# EAGLE design twilight-esp (EAGLE 7.5.0)
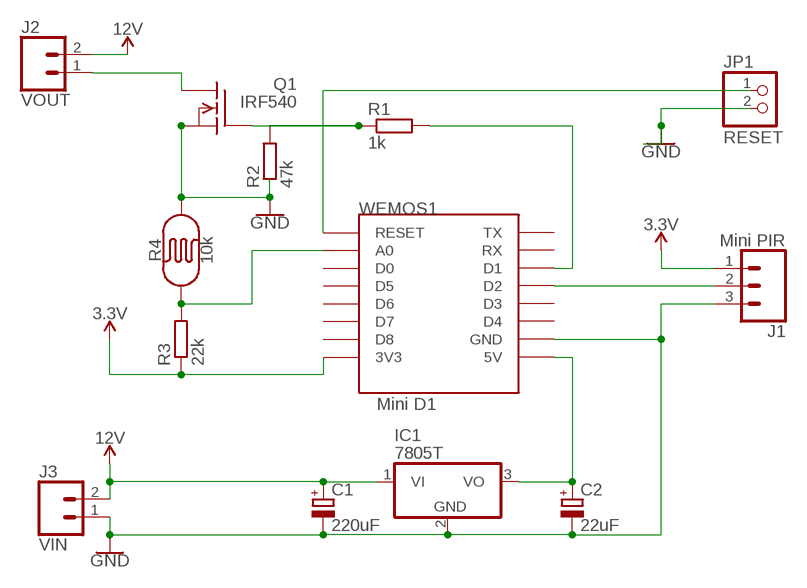
[diagram p0: schematic, sheet 1]

## Parts
C1  220uF  CPOL-EUE2-5  [E2-5]
C2  22uF  CPOL-EUE2-4  [E2-4]
IC1  7805T  [TO220H]
J1  Mini PIR  CONN_03  [1X03]
J2  VOUT  CONN_025MM  [SCREWTERMINAL-5MM-2]
J3  VIN  CONN_025MM  [SCREWTERMINAL-5MM-2]
JP1  RESET  PINHD-1X2  [1X02]
Q1  IRF540  [TO220]
R1  1k  R-EU_0207/7  [0207/7]
R2  47k  R-EU_0207/7  [0207/7]
R3  22k  R-EU_0207/7  [0207/7]
R4  10k  PHOTOCELLPTH  [PHOTOCELL]
WEMOS1  Mini D1  WEMOS-D1-MINI  [WEMOS-D1-MINI]

## Nets
3.3V: J1.1 R3.1 WEMOS1.3V3
12V: C1.+ IC1.1(VI) J2.2 J3.2
GND: C1.- C2.- IC1.2(GND) J1.3 J3.1 JP1.2 Q1.3(S) R2.1 R4.2 WEMOS1.GND
N$1: R1.2 WEMOS1.D1
N$2: Q1.1(G) R1.1 R2.2
N$3: R3.2 R4.1 WEMOS1.A0
N$4: JP1.1 WEMOS1.RESET
N$5: J2.1 Q1.2(D)
N$6: J1.2 WEMOS1.D2
N$8: C2.+ IC1.3(VO) WEMOS1.5V
Unconnected: WEMOS1.D0 WEMOS1.D3 WEMOS1.D4 WEMOS1.D5 WEMOS1.D6 WEMOS1.D7 WEMOS1.D8 WEMOS1.RX WEMOS1.TX

## Library data of the parts
C1 C2 = rcl:CPOL-EU: POLARIZED CAPACITOR, European symbol
IC1 = linear:78*: Positive VOLTAGE REGULATOR Source: http://cache.national.com/ds/LM/LM78L05.pdf http://www.fairchildsemi.com/ds/LM/LM7805.pdf
J1 = SparkFun-Connectors:CONN_03: Multi connection point. Often used as Generic Header-pin footprint for 0.1 inch spaced/style header connections On any of the 0.1 inch spaced packages, you can populate with these: Break Away Headers - Straight <https://www.sparkfun.com/products/116> (PRT-00116) Break Away Male Headers - Right Angle <https://www.sparkfun.com/products/553> (PRT-00553) Female Headers <https://www.sparkfun.com/products/115> (PRT-00115) Break Away Headers - Machine Pin <https://www.sparkfun.com/products/117> (PRT-00117) Break Away Female Headers - Swiss Machine Pin <https://www.sparkfun.com/products/743> (PRT-00743) Stackable Header - 3 Pin (Female, 0.1") <https://www.sparkfun.com/products/13875> (PRT-13875) For SCREWTERMINALS and SPRING TERMINALS visit here: Screw Terimnals on SparkFun.com <https://www.sparkfun.com/search/results?term=Screw+Terminals> (5mm/3.5mm/2.54mm spacing) This device is also useful as a general connection point to wire up your design to another part of your project. Our various solder wires solder well into these plated through hole pads. Hook-Up Wire - Assortment (Stranded, 22 AWG) <https://www.sparkfun.com/products/11375> (PRT-11375) Hook-Up Wire - Assortment (Solid Core, 22 AWG) <https://www.sparkfun.com/products/11367> (PRT-11367) View the entire wire category on our website here <https://www.sparkfun.com/categories/141> Special notes: Molex polarized connector foot print use with SKU : PRT-08232 with associated crimp pins and housings.; PROD_ID: XXX-00000; VALUE: 455-1750-1-ND
J2 J3 = SparkFun-Connectors:CONN_02: Multi connection point. Often used as Generic Header-pin footprint for 0.1 inch spaced/style header connections On any of the 0.1 inch spaced packages, you can populate with these: Break Away Headers - Straight <https://www.sparkfun.com/products/116> (PRT-00116) Break Away Male Headers - Right Angle <https://www.sparkfun.com/products/553> (PRT-00553) Female Headers <https://www.sparkfun.com/products/115> (PRT-00115) Break Away Headers - Machine Pin <https://www.sparkfun.com/products/117> (PRT-00117) Break Away Female Headers - Swiss Machine Pin <https://www.sparkfun.com/products/743> (PRT-00743) For SCREWTERMINALS and SPRING TERMINALS visit here: Screw Terimnals on SparkFun.com <https://www.sparkfun.com/search/results?term=Screw+Terminals> (5mm/3.5mm/2.54mm spacing) This device is also useful as a general connection point to wire up your design to another part of your project. Our various solder wires solder well into these plated through hole pads. Hook-Up Wire - Assortment (Stranded, 22 AWG) <https://www.sparkfun.com/products/11375> (PRT-11375) Hook-Up Wire - Assortment (Solid Core, 22 AWG) <https://www.sparkfun.com/products/11367> (PRT-11367) View the entire wire category on our website here <https://www.sparkfun.com/categories/141> Special notes: Molex polarized connector foot print use with: PRT-08233 with associated crimp pins and housings. 2.54_SCREWTERM for use with PRT-10571. 3.5mm Screw Terminal footprints for PRT-08084 5mm Screw Terminal footprints for use with PRT-08432; SF_SKU: PRT-08432
JP1 = pinhead:PINHD-1X2: PIN HEADER
Q1 = transistor-fet:IRF540: N-Channel Enhancement MOSFET (HEXFET); 100V; 28A; 0,077Ohm
R1-R3 = rcl:R-EU_: RESISTOR, European symbol
R4 = SparkFun-Sensors:PHOTOCELL: Photocell (Photodetector, Photo Resistor, CdS) This is a very small light sensor. A photocell changes (also called a photodetector, photo resistor, CdS or photoconductive cell) resistance depending on the amount of light it is exposed to. These little sensors make great ambient light triggers (when light in the room turns on, do something). Datasheet <http://cdn.sparkfun.com/datasheets/Sensors/LightImaging/SEN-09088.pdf> SparkFun Products Mini Photocell <https://www.sparkfun.com/products/9088> (SEN-09088); PROD_ID: COMP-09129; SF_ID: SEN-09088
WEMOS1 = esp8266modules:WEMOS-D1-MINI: WeMos.cc D1 mini ESP8266 module

## Board
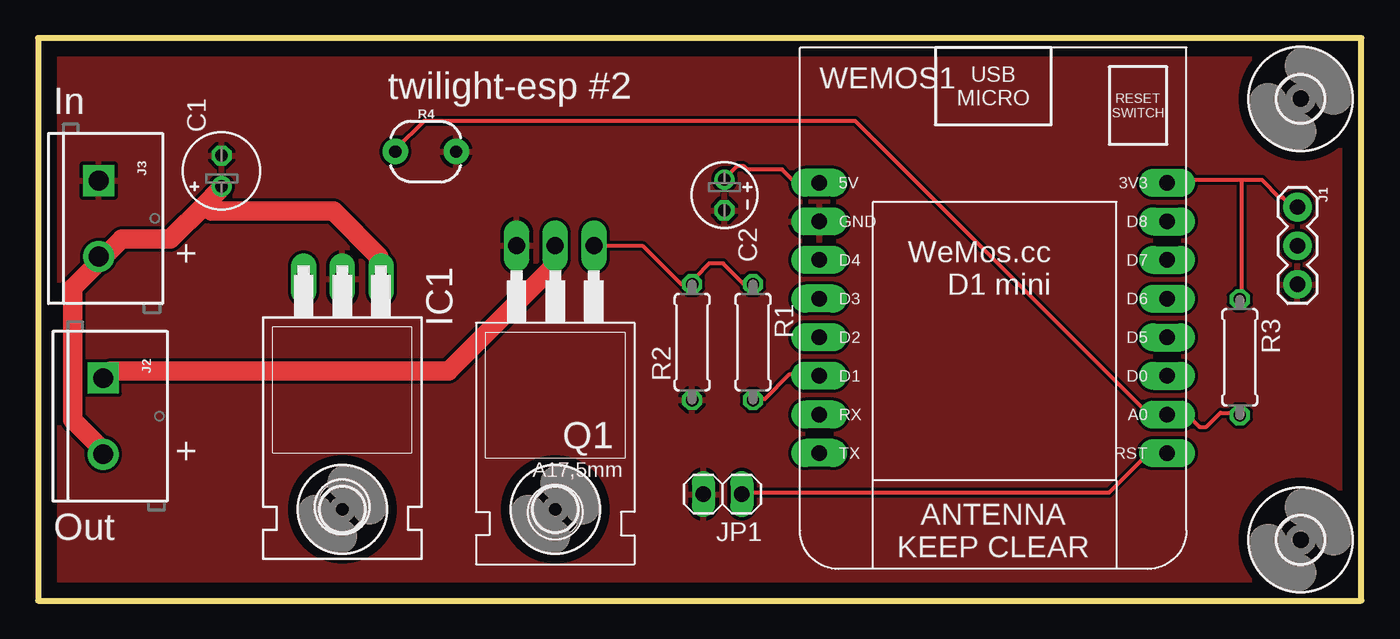
[diagram p1: board, top side]
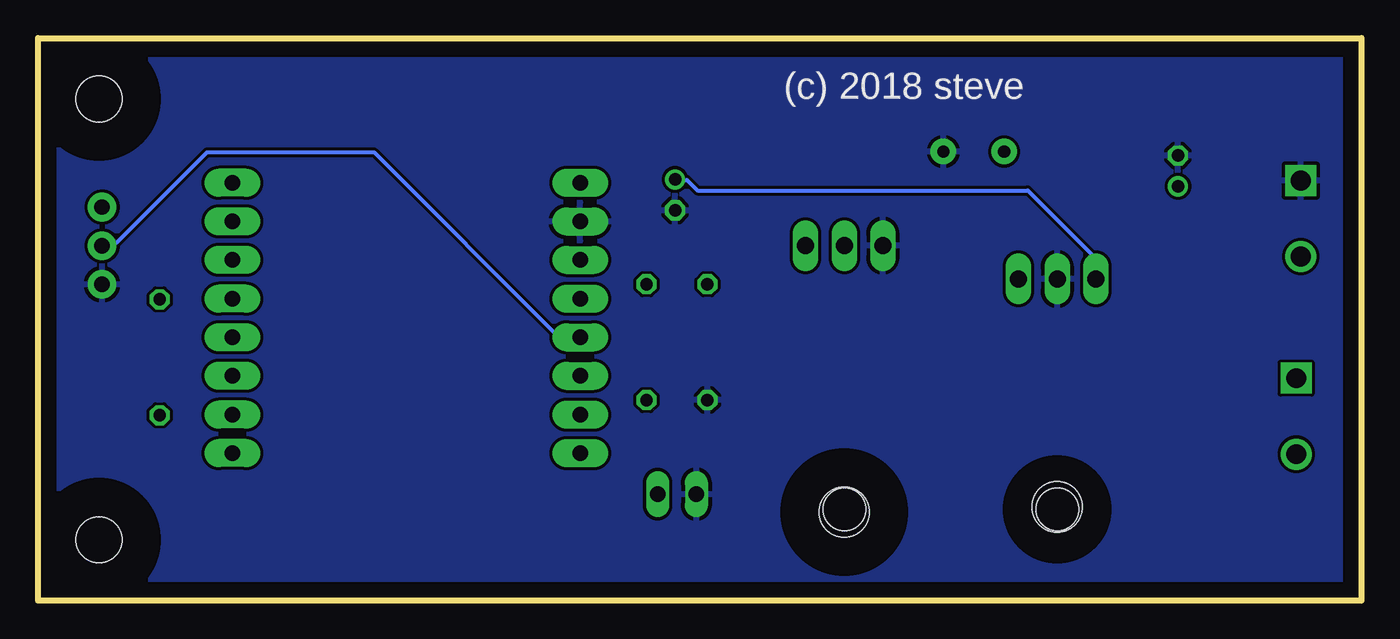
[diagram p2: board, bottom side, seen from below]

Size 87 x 37 mm. Coordinates in mm from the lower left corner, seen from the top.
Outline: 0,0 87,0 87,37 0,37 0,0
Copper layers (1*16): Top 0.035mm / dielectric 1.5mm / Bottom 0.035mm
Design rules "default": minimum track width 10mil, minimum drill 24mil, track to track 8mil, track to pad 8mil, pad to pad 8mil, via to via 8mil, smd to smd 8mil, copper to edge 40mil, drill to drill 8mil, minimum pad ring 10mil, minimum via ring 8mil, stop-mask expansion 4mil, vias tented up to drill 0mil, thermal gap 10mil

### Footprints (pad centres in the part's own frame; a part is rotated, then mirrored left to right if it is on the bottom)
E2-5 = drill 0.813 pad 1.27: + -1.016,0 | drill 0.813 pad 1.27 octagon: - 1.016,0
E2-4 = drill 0.813 pad 1.27: + -1.016,0 | drill 0.813 pad 1.27 octagon: - 1.016,0
TO220H = drill 1.118 long: 1 -2.54,-10.16; 2 0,-10.16; 3 2.54,-10.16 | hole 3.302: 0,4.826
1X03 = drill 1.016 pad 1.88: 1 0,0; 2 2.54,0; 3 5.08,0
SCREWTERMINAL-5MM-2 = drill 1.3 pad 2.032 square: 1 0,0 | drill 1.3 pad 2.032: 2 5,0
1X02 = drill 1.016 long: 1 -1.27,0; 2 1.27,0
TO220 = drill 1.118 long: 1 -2.54,-6.35; 2 0,-6.35; 3 2.54,-6.35 | hole 3.302: 0,11.176
0207/7 = drill 0.813 octagon: 1 -3.81,0; 2 3.81,0
PHOTOCELL = drill 0.8 pad 1.676: 1 -2,0; 2 2,0
2,8 = hole 2.8: 0,0
3,0 = hole 3: 0,0
WEMOS-D1-MINI = drill 1.016 pad 1.829 long: 3V3 -10.16,-10.16; 5V 12.7,-10.16; A0 -10.16,5.08; D0 -10.16,2.54; D1 12.7,2.54; D2 12.7,0; D3 12.7,-2.54; D4 12.7,-5.08; D5 -10.16,0; D6 -10.16,-2.54; D7 -10.16,-5.08; D8 -10.16,-7.62; GND 12.7,-7.62; RESET -10.16,7.62; RX 12.7,5.08; TX 12.7,7.62

### Placement (x,y rotation side)
C1  12.06,28.26 90 top
C2  45.12,26.68 270 top
IC1  20,11 180 top
J1  82.79,25.88 270 top
J2  4.29,14.63 270 top
J3  3.99,27.63 270 top
JP1  45,7 180 top
Q1  34,17 180 top
R1  47,17 270 top
R2  43,17 90 top
R3  79,16 270 top
R4  25.49,29.53 0 top
U$1  [2,8]  20,6 0 top
U$2  [2,8]  34,6 0 top
U$3  [3,0]  83,33 0 top
U$4  [3,0]  83,4 0 top
WEMOS1  64.06,17.32 180 top

### Tracks (layer width: path | path; a pad name or v marks a point on that pad's centre or on a via)
3.3V
  Top 0.254: 79.1,27.66 80.47,27.66 81.61,26.52 81.84,26.52 82.3,26.06 82.75,26.06 J1.1 | 79.1,27.66 74.3,27.66 WEMOS1.3V3 | 79.1,27.66 79.1,19.89 R3.1
12V
  Top 0.254: 11.89,26.98 11.89,27.2 C1.+ | 10.97,26.06 11.43,25.6 | 22.4,21.26 IC1.1 | 4.12,10.06 4.12,9.83 | 4.12,22.4 J3.2
  Top 1.27: 11.89,26.98 10.97,26.06 8.69,23.77 5.49,23.77 4.12,22.4 2.29,20.57 2.29,11.89 4.12,10.06 | 22.4,21.26 22.4,22.63 19.43,25.6 11.43,25.6 | 4.12,9.83 J2.2
GND
  pour Bottom: 0,37 87,37 87,0 0,0
  pour Top: 0,37 87,37 87,0 0,0
N$1
  Top 0.254: R1.2 47.09,13.26 47.78,13.26 49.38,14.86 51.21,14.86 WEMOS1.D1
N$2
  Top 0.254: R1.1 46.86,20.8 46.41,20.8 45.03,22.17 44.12,22.17 43.2,21.26 43.2,21.03 R2.2 42.98,20.8 42.29,20.8 39.78,23.32 36.58,23.32 Q1.1
N$3
  Top 0.254: R3.2 78.87,12.34 77.72,12.34 76.81,11.43 76.35,11.43 75.67,12.12 74.3,12.12 WEMOS1.A0 74.07,12.34 72.92,12.34 53.72,31.55 25.38,31.55 23.55,29.72 R4.1
N$4
  Top 0.254: JP1.1 46.41,7.09 70.41,7.09 72.92,9.6 74.07,9.6 WEMOS1.RESET
N$5
  Top 1.016: 4.34,14.63 4.8,15.09 | 33.83,23.32 Q1.2
  Top 1.27: 33.83,23.32 33.83,21.95 26.98,15.09 4.8,15.09 | 4.34,14.63 J2.1
N$6
  Bottom 0.254: WEMOS1.D2 51.44,17.37 52.81,17.37 64.92,29.49 75.89,29.49 81.84,23.55 82.75,23.55 J1.2
N$8
  Top 0.254: C2.+ 45.26,27.89 45.95,28.57 46.41,28.57 46.63,28.35 48.92,28.35 49.61,27.66 51.21,27.66 WEMOS1.5V
  Bottom 0.254: IC1.3 17.6,21.26 17.6,22.63 21.95,26.98 43.66,26.98 44.35,27.66 45.03,27.66 C2.+

### Text on the board
tPlace: twilight-esp #2 | In | + | + | Out
bPlace: (c) 2018 steve